# EAGLE design controller-teensy (EAGLE 6.4)
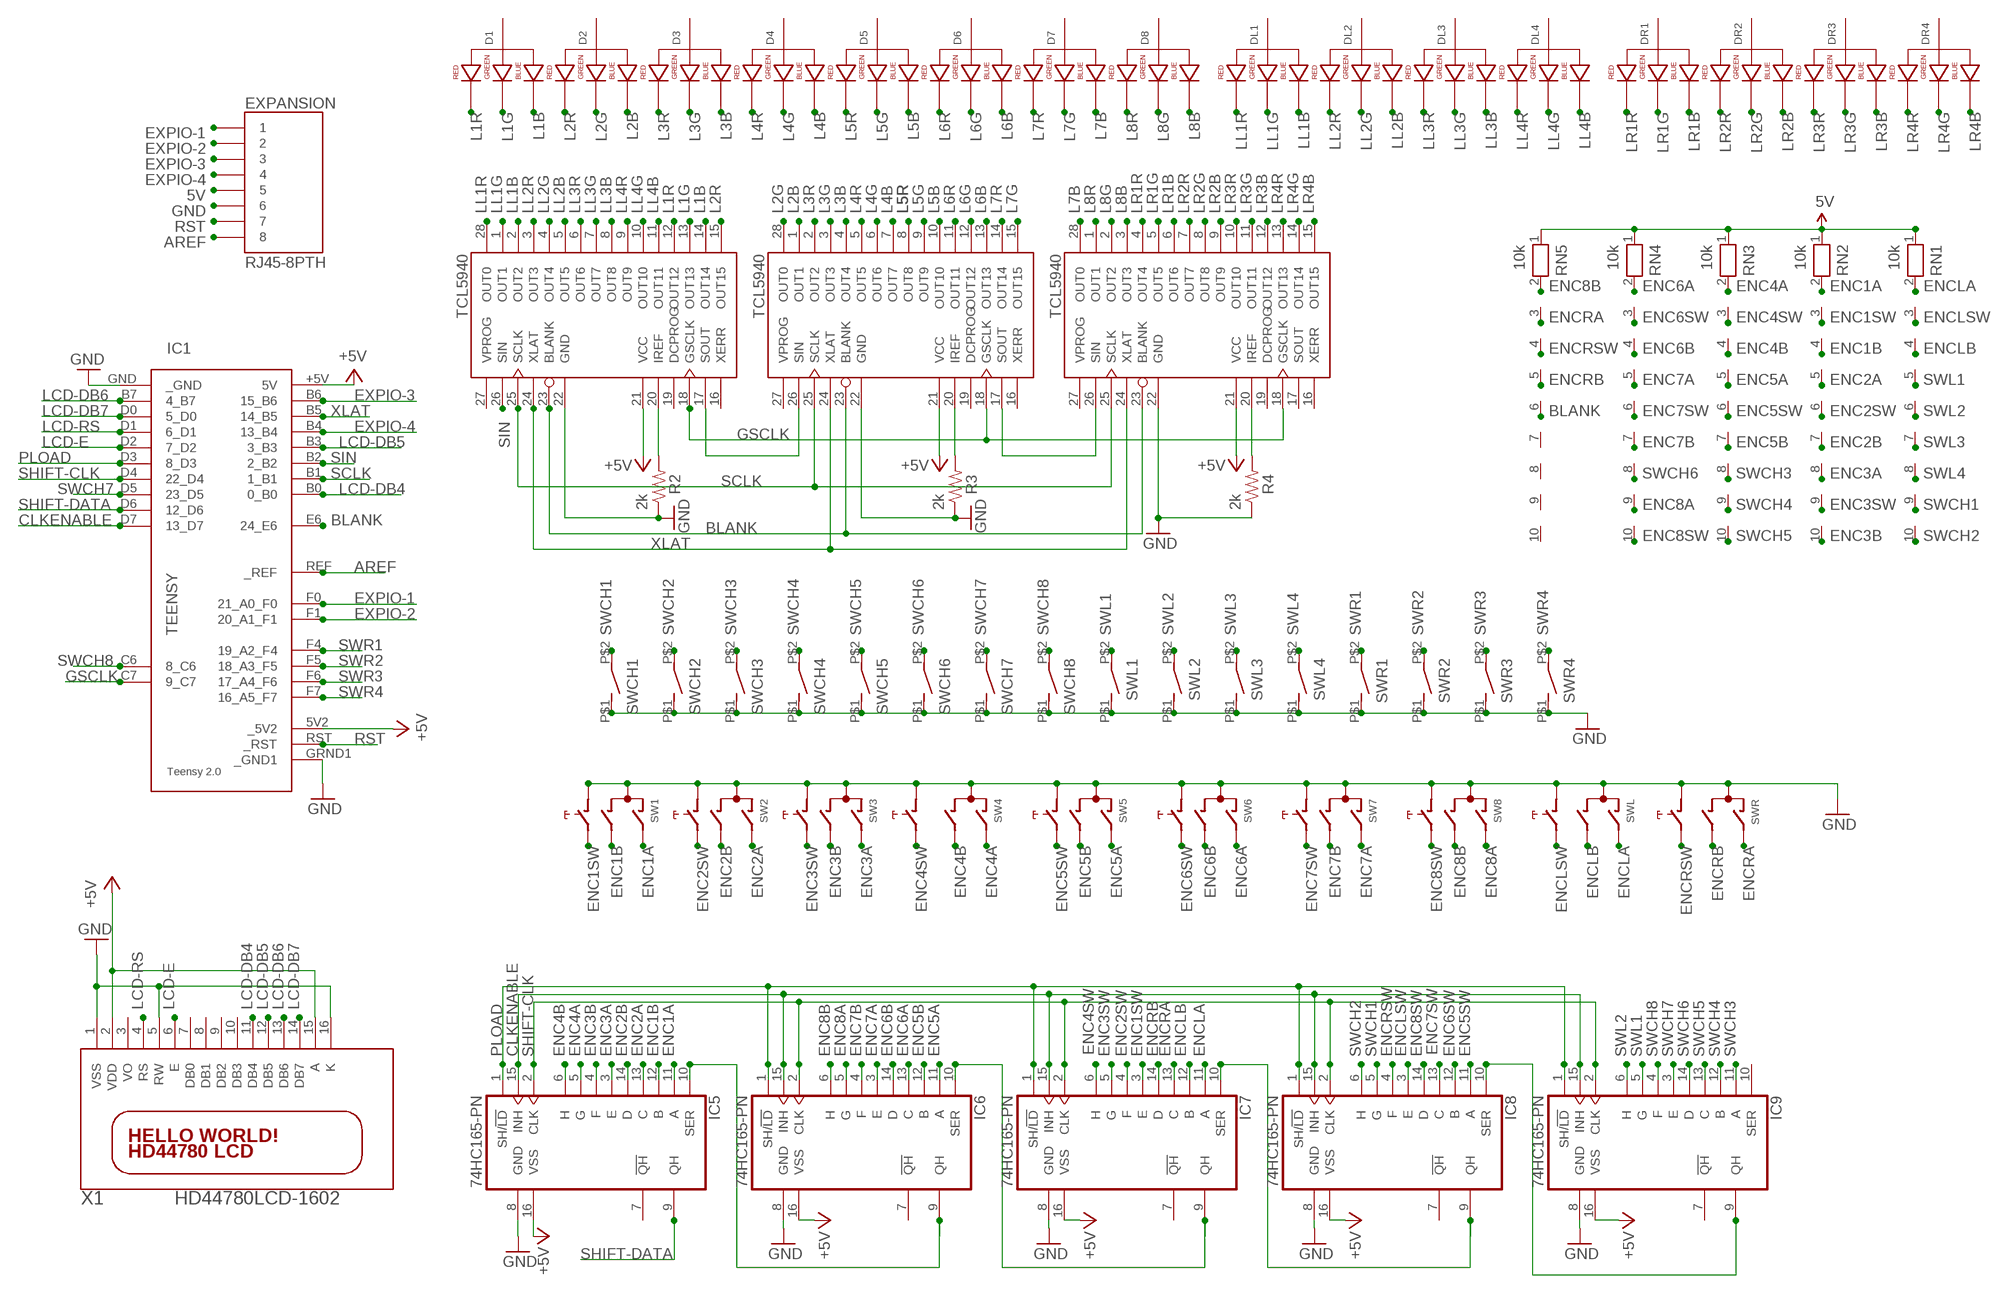
[diagram p0: schematic, sheet 1]

## Parts
D1  LED-RGB-CA-THRUDIFFUSE  [LED-RGB-THRU]
D2  LED-RGB-CA-THRUDIFFUSE  [LED-RGB-THRU]
D3  LED-RGB-CA-THRUDIFFUSE  [LED-RGB-THRU]
D4  LED-RGB-CA-THRUDIFFUSE  [LED-RGB-THRU]
D5  LED-RGB-CA-THRUDIFFUSE  [LED-RGB-THRU]
D6  LED-RGB-CA-THRUDIFFUSE  [LED-RGB-THRU]
D7  LED-RGB-CA-THRUDIFFUSE  [LED-RGB-THRU]
D8  LED-RGB-CA-THRUDIFFUSE  [LED-RGB-THRU]
DL1  LED-RGB-CA-THRUDIFFUSE  [LED-RGB-THRU]
DL2  LED-RGB-CA-THRUDIFFUSE  [LED-RGB-THRU]
DL3  LED-RGB-CA-THRUDIFFUSE  [LED-RGB-THRU]
DL4  LED-RGB-CA-THRUDIFFUSE  [LED-RGB-THRU]
DR1  LED-RGB-CA-THRUDIFFUSE  [LED-RGB-THRU]
DR2  LED-RGB-CA-THRUDIFFUSE  [LED-RGB-THRU]
DR3  LED-RGB-CA-THRUDIFFUSE  [LED-RGB-THRU]
DR4  LED-RGB-CA-THRUDIFFUSE  [LED-RGB-THRU]
EXPANSION  RJ45-8PTH  [RJ45-8]
IC1  TEENSY  [TEENSY]
IC2  LEDPWM1  TCL5940  [DIP28]
IC3  LEDPWM2  TCL5940  [DIP28]
IC4  LEDPWM3  TCL5940  [DIP28]
IC5  74HC165-PN  [DIL16]
IC6  74HC165-PN  [DIL16]
IC7  74HC165-PN  [DIL16]
IC8  74HC165-PN  [DIL16]
IC9  74HC165-PN  [DIL16]
R2  2k  R-US_0207/10  [0207/10]
R3  2k  R-US_0207/10  [0207/10]
R4  2k  R-US_0207/10  [0207/10]
RN1  10k  RN09  [RN-10]
RN2  10k  RN09  [RN-10]
RN3  10k  RN09  [RN-10]
RN4  10k  RN09  [RN-10]
RN5  10k  RN09  [RN-10]
SW1  EC12E_SW  [ALPS_EC12E_SW]
SW2  EC12E_SW  [ALPS_EC12E_SW]
SW3  EC12E_SW  [ALPS_EC12E_SW]
SW4  EC12E_SW  [ALPS_EC12E_SW]
SW5  EC12E_SW  [ALPS_EC12E_SW]
SW6  EC12E_SW  [ALPS_EC12E_SW]
SW7  EC12E_SW  [ALPS_EC12E_SW]
SW8  EC12E_SW  [ALPS_EC12E_SW]
SWCH1  BPM  [BMP]
SWCH2  BPM  [BMP]
SWCH3  BPM  [BMP]
SWCH4  BPM  [BMP]
SWCH5  BPM  [BMP]
SWCH6  BPM  [BMP]
SWCH7  BPM  [BMP]
SWCH8  BPM  [BMP]
SWL  EC12E_SW  [ALPS_EC12E_SW]
SWL1  BPM  [BMP]
SWL2  BPM  [BMP]
SWL3  BPM  [BMP]
SWL4  BPM  [BMP]
SWR  EC12E_SW  [ALPS_EC12E_SW]
SWR1  BPM  [BMP]
SWR2  BPM  [BMP]
SWR3  BPM  [BMP]
SWR4  BPM  [BMP]
X1  HD44780LCD-1602  [LCD1602]

## Nets
5V: EXPANSION.5 RN1.1 RN2.1 RN3.1 RN4.1 RN5.1
+5V: IC1.5V2(_5V2) IC1.+5V(5V) IC2.21(VCC) IC3.21(VCC) IC4.21(VCC) IC5.16(VSS) IC6.16(VSS) IC7.16(VSS) IC8.16(VSS) IC9.16(VSS) X1.2(VDD) X1.15(A)
AREF: EXPANSION.8 IC1.REF(_REF)
BLANK: IC1.E6(24_E6) IC2.23(BLANK) IC3.23(BLANK) IC4.23(BLANK) RN5.6
CLKENABLE: IC1.D7(13_D7) IC5.15(INH) IC6.15(INH) IC7.15(INH) IC8.15(INH) IC9.15(INH)
ENC1A: IC5.11(A) RN2.2 SW1.A
ENC1B: IC5.12(B) RN2.4 SW1.B
ENC1SW: IC7.3(E) RN2.3 SW1.E
ENC2A: IC5.13(C) RN2.5 SW2.A
ENC2B: IC5.14(D) RN2.7 SW2.B
ENC2SW: IC7.4(F) RN2.6 SW2.E
ENC3A: IC5.3(E) RN2.8 SW3.A
ENC3B: IC5.4(F) RN2.10 SW3.B
ENC3SW: IC7.5(G) RN2.9 SW3.E
ENC4A: IC5.5(G) RN3.2 SW4.A
ENC4B: IC5.6(H) RN3.4 SW4.B
ENC4SW: IC7.6(H) RN3.3 SW4.E
ENC5A: IC6.11(A) RN3.5 SW5.A
ENC5B: IC6.12(B) RN3.7 SW5.B
ENC5SW: IC8.11(A) RN3.6 SW5.E
ENC6A: IC6.13(C) RN4.2 SW6.A
ENC6B: IC6.14(D) RN4.4 SW6.B
ENC6SW: IC8.12(B) RN4.3 SW6.E
ENC7A: IC6.3(E) RN4.5 SW7.A
ENC7B: IC6.4(F) RN4.7 SW7.B
ENC7SW: IC8.13(C) RN4.6 SW7.E
ENC8A: IC6.5(G) RN4.9 SW8.A
ENC8B: IC6.6(H) RN5.2 SW8.B
ENC8SW: IC8.14(D) RN4.10 SW8.E
ENCLA: IC7.11(A) RN1.2 SWL.A
ENCLB: IC7.12(B) RN1.4 SWL.B
ENCLSW: IC8.3(E) RN1.3 SWL.E
ENCRA: IC7.13(C) RN5.3 SWR.A
ENCRB: IC7.14(D) RN5.5 SWR.B
ENCRSW: IC8.4(F) RN5.4 SWR.E
EXPIO-1: EXPANSION.1 IC1.F0(21_A0_F0)
EXPIO-2: EXPANSION.2 IC1.F1(20_A1_F1)
EXPIO-3: EXPANSION.3 IC1.B6(15_B6)
EXPIO-4: EXPANSION.4 IC1.B4(13_B4)
GND: EXPANSION.6 IC1.GND(_GND) IC1.GRND1(_GND1) IC2.22(GND) IC3.22(GND) IC4.22(GND) IC5.8(GND) IC6.8(GND) IC7.8(GND) IC8.8(GND) IC9.8(GND) R2.1 R3.1 R4.1 SW1.C SW1.D SW2.C SW2.D SW3.C SW3.D SW4.C SW4.D SW5.C SW5.D SW6.C SW6.D SW7.C SW7.D SW8.C SW8.D SWCH1.P$1 SWCH2.P$1 SWCH3.P$1 SWCH4.P$1 SWCH5.P$1 SWCH6.P$1 SWCH7.P$1 SWCH8.P$1 SWL1.P$1 SWL2.P$1 SWL3.P$1 SWL4.P$1 SWL.C SWL.D SWR1.P$1 SWR2.P$1 SWR3.P$1 SWR4.P$1 SWR.C SWR.D X1.1(VSS) X1.5(RW) X1.16(K)
GSCLK: IC1.C7(9_C7) IC2.18(GSCLK) IC3.18(GSCLK) IC4.18(GSCLK)
L1B: D1.4(BLUE_CATHODE) IC2.14(OUT14)
L1G: D1.3(GREEN_CATHODE) IC2.13(OUT13)
L1R: D1.1(RED_CATHODE) IC2.12(OUT12)
L2B: D2.4(BLUE_CATHODE) IC3.1(OUT1)
L2G: D2.3(GREEN_CATHODE) IC3.28(OUT0)
L2R: D2.1(RED_CATHODE) IC2.15(OUT15)
L3B: D3.4(BLUE_CATHODE) IC3.4(OUT4)
L3G: D3.3(GREEN_CATHODE) IC3.3(OUT3)
L3R: D3.1(RED_CATHODE) IC3.2(OUT2)
L4B: D4.4(BLUE_CATHODE) IC3.7(OUT7)
L4G: D4.3(GREEN_CATHODE) IC3.6(OUT6)
L4R: D4.1(RED_CATHODE) IC3.5(OUT5)
L5B: D5.4(BLUE_CATHODE) IC3.10(OUT10)
L5G: D5.3(GREEN_CATHODE) IC3.9(OUT9)
L5R: D5.1(RED_CATHODE) IC3.8(OUT8)
L6B: D6.4(BLUE_CATHODE) IC3.13(OUT13)
L6G: D6.3(GREEN_CATHODE) IC3.12(OUT12)
L6R: D6.1(RED_CATHODE) IC3.11(OUT11)
L7B: D7.4(BLUE_CATHODE) IC4.28(OUT0)
L7G: D7.3(GREEN_CATHODE) IC3.15(OUT15)
L7R: D7.1(RED_CATHODE) IC3.14(OUT14)
L8B: D8.4(BLUE_CATHODE) IC4.3(OUT3)
L8G: D8.3(GREEN_CATHODE) IC4.2(OUT2)
L8R: D8.1(RED_CATHODE) IC4.1(OUT1)
LCD-DB4: IC1.B0(0_B0) X1.11(DB4)
LCD-DB5: IC1.B3(3_B3) X1.12(DB5)
LCD-DB6: IC1.B7(4_B7) X1.13(DB6)
LCD-DB7: IC1.D0(5_D0) X1.14(DB7)
LCD-E: IC1.D2(7_D2) X1.6(E)
LCD-RS: IC1.D1(6_D1) X1.4(RS)
LL1B: DL1.4(BLUE_CATHODE) IC2.2(OUT2)
LL1G: DL1.3(GREEN_CATHODE) IC2.1(OUT1)
LL1R: DL1.1(RED_CATHODE) IC2.28(OUT0)
LL2B: DL2.4(BLUE_CATHODE) IC2.5(OUT5)
LL2G: DL2.3(GREEN_CATHODE) IC2.4(OUT4)
LL2R: DL2.1(RED_CATHODE) IC2.3(OUT3)
LL3B: DL3.4(BLUE_CATHODE) IC2.8(OUT8)
LL3G: DL3.3(GREEN_CATHODE) IC2.7(OUT7)
LL3R: DL3.1(RED_CATHODE) IC2.6(OUT6)
LL4B: DL4.4(BLUE_CATHODE) IC2.11(OUT11)
LL4G: DL4.3(GREEN_CATHODE) IC2.10(OUT10)
LL4R: DL4.1(RED_CATHODE) IC2.9(OUT9)
LR1B: DR1.4(BLUE_CATHODE) IC4.6(OUT6)
LR1G: DR1.3(GREEN_CATHODE) IC4.5(OUT5)
LR1R: DR1.1(RED_CATHODE) IC4.4(OUT4)
LR2B: DR2.4(BLUE_CATHODE) IC4.9(OUT9)
LR2G: DR2.3(GREEN_CATHODE) IC4.8(OUT8)
LR2R: DR2.1(RED_CATHODE) IC4.7(OUT7)
LR3B: DR3.4(BLUE_CATHODE) IC4.12(OUT12)
LR3G: DR3.3(GREEN_CATHODE) IC4.11(OUT11)
LR3R: DR3.1(RED_CATHODE) IC4.10(OUT10)
LR4B: DR4.4(BLUE_CATHODE) IC4.15(OUT15)
LR4G: DR4.3(GREEN_CATHODE) IC4.14(OUT14)
LR4R: DR4.1(RED_CATHODE) IC4.13(OUT13)
N$10: IC3.20(IREF) R3.2
N$13: IC2.20(IREF) R2.2
N$14: IC2.17(SOUT) IC3.26(SIN)
N$15: IC3.17(SOUT) IC4.26(SIN)
N$16: IC4.20(IREF) R4.2
N$21: IC5.10(SER) IC6.9(QH)
N$22: IC6.10(SER) IC7.9(QH)
N$23: IC7.10(SER) IC8.9(QH)
N$33: IC8.10(SER) IC9.9(QH)
PLOAD: IC1.D3(8_D3) IC5.1(SH/!LD) IC6.1(SH/!LD) IC7.1(SH/!LD) IC8.1(SH/!LD) IC9.1(SH/!LD)
RST: EXPANSION.7 IC1.RST(_RST)
SCLK: IC1.B1(1_B1) IC2.25(SCLK) IC3.25(SCLK) IC4.25(SCLK)
SHIFT-CLK: IC1.D4(22_D4) IC5.2(CLK) IC6.2(CLK) IC7.2(CLK) IC8.2(CLK) IC9.2(CLK)
SHIFT-DATA: IC1.D6(12_D6) IC5.9(QH)
SIN: IC1.B2(2_B2) IC2.26(SIN)
SWCH1: IC8.5(G) RN1.9 SWCH1.P$2
SWCH2: IC8.6(H) RN1.10 SWCH2.P$2
SWCH3: IC9.11(A) RN3.8 SWCH3.P$2
SWCH4: IC9.12(B) RN3.9 SWCH4.P$2
SWCH5: IC9.13(C) RN3.10 SWCH5.P$2
SWCH6: IC9.14(D) RN4.8 SWCH6.P$2
SWCH7: IC1.D5(23_D5) IC9.3(E) SWCH7.P$2
SWCH8: IC1.C6(8_C6) IC9.4(F) SWCH8.P$2
SWL1: IC9.5(G) RN1.5 SWL1.P$2
SWL2: IC9.6(H) RN1.6 SWL2.P$2
SWL3: RN1.7 SWL3.P$2
SWL4: RN1.8 SWL4.P$2
SWR1: IC1.F4(19_A2_F4) SWR1.P$2
SWR2: IC1.F5(18_A3_F5) SWR2.P$2
SWR3: IC1.F6(17_A4_F6) SWR3.P$2
SWR4: IC1.F7(16_A5_F7) SWR4.P$2
XLAT: IC1.B5(14_B5) IC2.24(XLAT) IC3.24(XLAT) IC4.24(XLAT)
Unconnected: D1.2(ANODE) D2.2(ANODE) D3.2(ANODE) D4.2(ANODE) D5.2(ANODE) D6.2(ANODE) D7.2(ANODE) D8.2(ANODE) DL1.2(ANODE) DL2.2(ANODE) DL3.2(ANODE) DL4.2(ANODE) DR1.2(ANODE) DR2.2(ANODE) DR3.2(ANODE) DR4.2(ANODE) IC2.16(XERR) IC2.19(DCPROG) IC2.27(VPROG) IC3.16(XERR) IC3.19(DCPROG) IC3.27(VPROG) IC4.16(XERR) IC4.17(SOUT) IC4.19(DCPROG) IC4.27(VPROG) IC5.7(!QH) IC6.7(!QH) IC7.7(!QH) IC8.7(!QH) IC9.7(!QH) IC9.10(SER) RN5.7 RN5.8 RN5.9 RN5.10 SW1.GND1(G) SW1.GND2(G) SW2.GND1(G) SW2.GND2(G) SW3.GND1(G) SW3.GND2(G) SW4.GND1(G) SW4.GND2(G) SW5.GND1(G) SW5.GND2(G) SW6.GND1(G) SW6.GND2(G) SW7.GND1(G) SW7.GND2(G) SW8.GND1(G) SW8.GND2(G) SWL.GND1(G) SWL.GND2(G) SWR.GND1(G) SWR.GND2(G) X1.3(VO) X1.7(DB0) X1.8(DB1) X1.9(DB2) X1.10(DB3)

## Library data of the parts
D1-D8 DL1-DL4 DR1-DR4 = SparkFun-LED:LED-RGB-CA-THRU: RGB Through-hole common anode SparkFun store front COM-10821 (diffuse) COM-10820 (clear); PROD_ID: DIO-10632
EXPANSION = SparkFun:RJ45-8: RJ45 Jack Simple RJ45, 8-pin connection - connector for common Cat5, Cat5e, and Cat6 Ethernet cables. Footprint not yet proven in production. Connector sku is PRT-00643; Breakout PCB sku is BOB-00716.
IC1 = teensy:TEENSY: Teensy 2.0 Original Design by Clint Fisher Modified Design by Tamir Emran Licensed Under Creative Commons Attribution-ShareAlike 3.0 Unported (CC BY-SA 3.0)
IC2-IC4 = tcl5940:TCL5940: 16-Channel 12-Bit LED Driver
IC5-IC9 = 74xx-us:74*165-P: 8-bit parallel load SHIFT REGISTER; PWR: 1
R2-R4 = resistor:R-US_: RESISTOR, American symbol
RN1-RN5 = resistor-net:RN09: RESISTOR NETWORK; OC_FARNELL: unknown; OC_NEWARK: unknown
SW1-SW8 SWL SWR = switch-alps:EC12E_SW: ALPS rotary Encoder EC12E series with switch; MPN: EC12E2424407; OC_FARNELL: 1520813; OC_NEWARK: 74M1068
SWCH1-SWCH8 SWL1-SWL4 SWR1-SWR4 = livid:BPM
X1 = adafruit:HD44780LCD: HD44780 LCD Standard character type LCDs, available in sizes from 8x1 to 40x4!

## Board
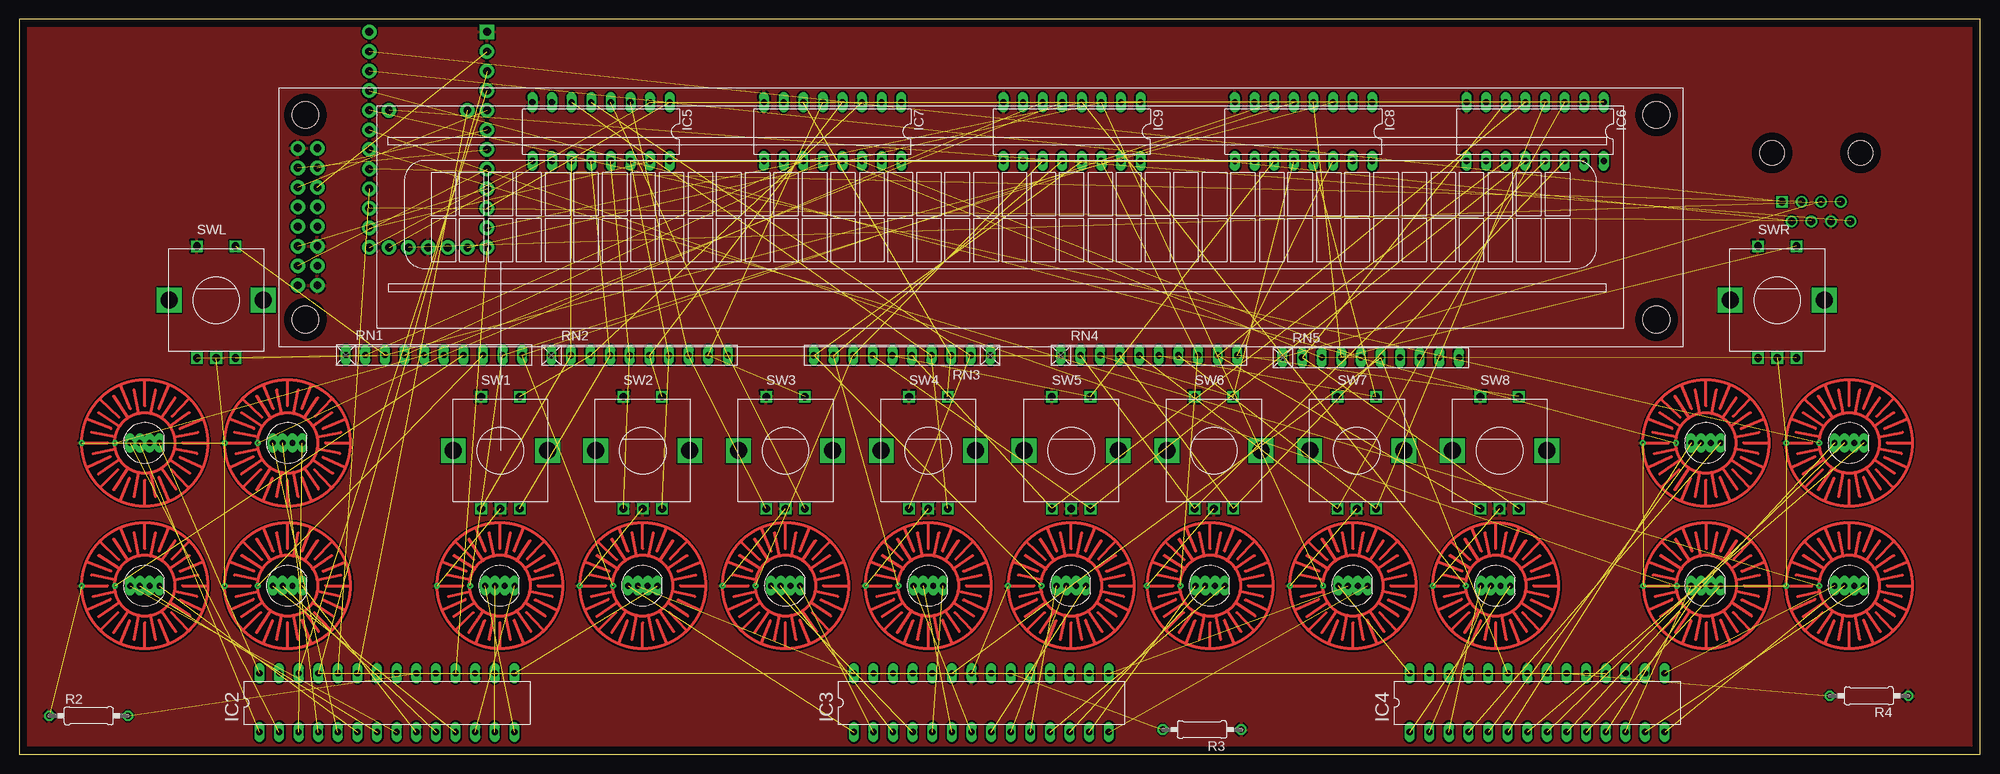
[diagram p1: board, top side]
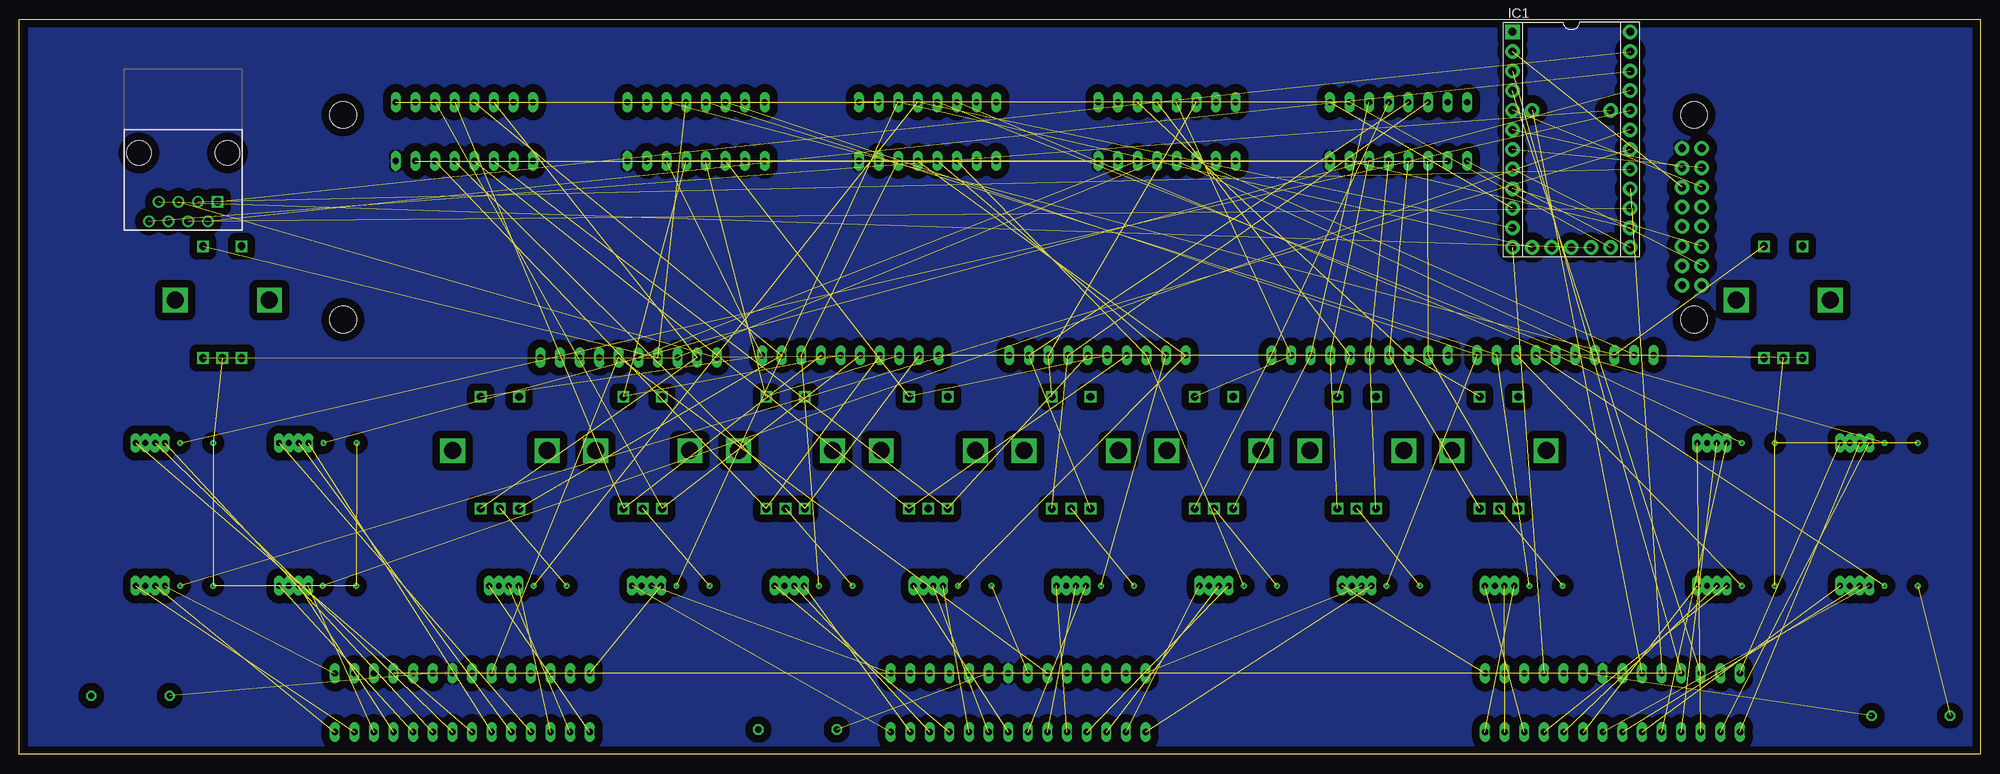
[diagram p2: board, bottom side, seen from below]

Size 254 x 95.25 mm. Coordinates in mm from the lower left corner, seen from the top.
Outline: 0,0 254,0 254,95.25 0,95.25 0,0
Copper layers (1*16): Top 0.035mm / dielectric 1.5mm / Bottom 0.035mm
Design rules "default": minimum track width 10mil, minimum drill 24mil, track to track 8mil, track to pad 8mil, pad to pad 8mil, via to via 8mil, smd to smd 8mil, copper to edge 40mil, drill to drill 8mil, minimum pad ring 10mil, minimum via ring 8mil, stop-mask expansion 4mil, vias tented up to drill 0mil, thermal gap 10mil

### Footprints (pad centres in the part's own frame; a part is rotated, then mirrored left to right if it is on the bottom)
LED-RGB-THRU = drill 0.762 pad 0.889 long: 1 1.905,0; 2 0.635,0; 3 -0.635,0; 4 -1.905,0
RJ45-8 = drill 1 square: 1 -4.445,6.35 | drill 1: 2 -3.175,8.89; 3 -1.905,6.35; 4 -0.635,8.89; 5 0.635,6.35; 6 1.905,8.89; 7 3.175,6.35; 8 4.445,8.89 | hole 3.2: -5.715,0; 5.715,0
TEENSY = drill 1.016 pad 1.88: 5V2 13.97,-2.54; +5V -13.97,7.62; B0 -11.43,-7.62; B1 -8.89,-7.62; B2 -6.35,-7.62; B3 -3.81,-7.62; B4 8.89,7.62; B5 6.35,7.62; B6 3.81,7.62; B7 -1.27,-7.62; C6 11.43,-7.62; C7 13.97,-7.62; D0 1.27,-7.62; D1 3.81,-7.62; D2 6.35,-7.62; D3 8.89,-7.62; D4 13.97,5.08; D5 13.97,-5.08; D6 13.97,7.62; D7 11.43,7.62; E6 -3.81,-5.08; F0 -11.43,7.62; F1 -8.89,7.62; F4 -6.35,7.62; F5 -3.81,7.62; F6 -1.27,7.62; F7 1.27,7.62; GRND1 13.97,0; REF -3.81,5.08; RST 13.97,2.54 | drill 1.016 pad 1.88 square: GND -13.97,-7.62
DIP28 = drill 0.813 long: 1 -15.24,-3.81; 2 -12.7,-3.81; 3 -10.16,-3.81; 4 -7.62,-3.81; 5 -5.08,-3.81; 6 -2.54,-3.81; 7 0,-3.81; 8 2.54,-3.81; 9 5.08,-3.81; 10 7.62,-3.81; 11 10.16,-3.81; 12 12.7,-3.81; 13 15.24,-3.81; 14 17.78,-3.81; 15 17.78,3.81; 16 15.24,3.81; 17 12.7,3.81; 18 10.16,3.81; 19 7.62,3.81; 20 5.08,3.81; 21 2.54,3.81; 22 0,3.81; 23 -2.54,3.81; 24 -5.08,3.81; 25 -7.62,3.81; 26 -10.16,3.81; 27 -12.7,3.81; 28 -15.24,3.81
DIL16 = drill 0.813 long: 1 -8.89,-3.81; 2 -6.35,-3.81; 3 -3.81,-3.81; 4 -1.27,-3.81; 5 1.27,-3.81; 6 3.81,-3.81; 7 6.35,-3.81; 8 8.89,-3.81; 9 8.89,3.81; 10 6.35,3.81; 11 3.81,3.81; 12 1.27,3.81; 13 -1.27,3.81; 14 -3.81,3.81; 15 -6.35,3.81; 16 -8.89,3.81
0207/10 = drill 0.813 octagon: 1 -5.08,0; 2 5.08,0
RN-10 = drill 0.813 long: 1 -11.43,0; 2 -8.89,0; 3 -6.35,0; 4 -3.81,0; 5 -1.27,0; 6 1.27,0; 7 3.81,0; 8 6.35,0; 9 8.89,0; 10 11.43,0
ALPS_EC12E_SW = drill 1 square: A -2.5,-7.5; B 2.5,-7.5; C 0,-7.5; D -2.5,7; E 2.5,7 | drill 2.2 square: GND1 -6.1,0; GND2 6.1,0
BMP = drill 0.254: P$1 -8.159,0; P$2 -3.858,0
LCD1602 = drill 1.016 pad 1.88: 1 5.04,7.92; 2 2.5,7.92; 3 5.04,10.46; 4 2.5,10.46; 5 5.04,13; 6 2.5,13; 7 5.04,15.54; 8 2.5,15.54; 9 5.04,18.08; 10 2.5,18.08; 11 5.04,20.62; 12 2.5,20.62; 13 5.04,23.16; 14 2.5,23.16; 15 5.04,25.7; 16 2.5,25.7 | hole 3.5: 3.5,3.5; 3.5,30; 178.5,30; 178.5,3.5

### Placement (x,y rotation side)
D1  62.25,21.85 0 top
D2  80.75,21.85 0 top
D3  99.25,21.85 0 top
D4  117.75,21.85 0 top
D5  136.25,21.85 0 top
D6  154.25,21.85 0 top
D7  172.75,21.85 0 top
D8  191.25,21.85 0 top
DL1  16.25,40.35 0 top
DL2  34.75,40.35 0 top
DL3  16.25,21.85 0 top
DL4  34.75,21.85 0 top
DR1  218.46,40.35 0 top
DR2  237.04,40.35 0 top
DR3  218.46,21.85 0 top
DR4  237.04,21.85 0 top
EXPANSION  232.76,77.96 180 bottom
IC1  52.96,79.65 270 bottom
IC2  46.35,6.7 0 top
IC3  123.35,6.7 0 top
IC4  195.35,6.7 0 top
IC5  75.35,80.7 180 top
IC6  196.35,80.7 180 top
IC7  105.35,80.7 180 top
IC8  166.35,80.7 180 top
IC9  136.35,80.7 180 top
R2  8.99,4.99 0 top
R3  153.2,3.21 180 top
R4  239.59,7.59 180 top
RN1  53.72,51.75 0 top
RN2  80.35,51.7 0 top
RN3  114.35,51.7 180 top
RN4  146.35,51.7 0 top
RN5  175.07,51.41 0 top
SW1  62.32,39.35 0 top
SW2  80.75,39.35 0 top
SW3  99.25,39.35 0 top
SW4  117.75,39.35 0 top
SW5  136.25,39.35 0 top
SW6  154.75,39.35 0 top
SW7  173.25,39.35 0 top
SW8  191.75,39.35 0 top
SWCH1  62.25,21.85 0 top
SWCH2  80.75,21.85 0 top
SWCH3  99.25,21.85 0 top
SWCH4  117.75,21.85 0 top
SWCH5  136.25,21.85 0 top
SWCH6  154.25,21.85 0 top
SWCH7  172.75,21.85 0 top
SWCH8  191.25,21.85 0 top
SWL  25.5,58.85 0 top
SWL1  16.25,40.35 0 top
SWL2  34.75,40.35 0 top
SWL3  16.25,21.85 0 top
SWL4  34.75,21.85 0 top
SWR  227.71,58.85 0 top
SWR1  218.46,40.35 0 top
SWR2  237.04,40.35 0 top
SWR3  218.54,21.85 0 top
SWR4  237.04,21.85 0 top
X1  33.57,52.85 0 top

### Tracks (layer width: path | path; a pad name or v marks a point on that pad's centre or on a via)
5V  (5 unrouted)
+5V
  pour Bottom (isolate 1.016): 1,94.05 252.7,94.05 252.7,1 1,1
AREF  (1 unrouted)
BLANK  (4 unrouted)
CLKENABLE  (5 unrouted)
ENC1A  (2 unrouted)
ENC1B  (2 unrouted)
ENC1SW  (2 unrouted)
ENC2A  (2 unrouted)
ENC2B  (2 unrouted)
ENC2SW  (2 unrouted)
ENC3A  (2 unrouted)
ENC3B  (2 unrouted)
ENC3SW  (2 unrouted)
ENC4A  (2 unrouted)
ENC4B  (2 unrouted)
ENC4SW  (2 unrouted)
ENC5A  (2 unrouted)
ENC5B  (2 unrouted)
ENC5SW  (2 unrouted)
ENC6A  (2 unrouted)
ENC6B  (2 unrouted)
ENC6SW  (2 unrouted)
ENC7A  (2 unrouted)
ENC7B  (2 unrouted)
ENC7SW  (2 unrouted)
ENC8A  (2 unrouted)
ENC8B  (2 unrouted)
ENC8SW  (2 unrouted)
ENCLA  (2 unrouted)
ENCLB  (2 unrouted)
ENCLSW  (2 unrouted)
ENCRA  (2 unrouted)
ENCRB  (2 unrouted)
ENCRSW  (2 unrouted)
EXPIO-1  (1 unrouted)
EXPIO-2  (1 unrouted)
EXPIO-3  (1 unrouted)
EXPIO-4  (1 unrouted)
GND  (16 unrouted)
  pour Top: 0,95.05 253.7,95.05 253.7,1 0,1
GSCLK  (3 unrouted)
L1B  (1 unrouted)
L1G  (1 unrouted)
L1R  (1 unrouted)
L2B  (1 unrouted)
L2G  (1 unrouted)
L2R  (1 unrouted)
L3B  (1 unrouted)
L3G  (1 unrouted)
L3R  (1 unrouted)
L4B  (1 unrouted)
L4G  (1 unrouted)
L4R  (1 unrouted)
L5B  (1 unrouted)
L5G  (1 unrouted)
L5R  (1 unrouted)
L6B  (1 unrouted)
L6G  (1 unrouted)
L6R  (1 unrouted)
L7B  (1 unrouted)
L7G  (1 unrouted)
L7R  (1 unrouted)
L8B  (1 unrouted)
L8G  (1 unrouted)
L8R  (1 unrouted)
LCD-DB4  (1 unrouted)
LCD-DB5  (1 unrouted)
LCD-DB6  (1 unrouted)
LCD-DB7  (1 unrouted)
LCD-E  (1 unrouted)
LCD-RS  (1 unrouted)
LL1B  (1 unrouted)
LL1G  (1 unrouted)
LL1R  (1 unrouted)
LL2B  (1 unrouted)
LL2G  (1 unrouted)
LL2R  (1 unrouted)
LL3B  (1 unrouted)
LL3G  (1 unrouted)
LL3R  (1 unrouted)
LL4B  (1 unrouted)
LL4G  (1 unrouted)
LL4R  (1 unrouted)
LR1B  (1 unrouted)
LR1G  (1 unrouted)
LR1R  (1 unrouted)
LR2B  (1 unrouted)
LR2G  (1 unrouted)
LR2R  (1 unrouted)
LR3B  (1 unrouted)
LR3G  (1 unrouted)
LR3R  (1 unrouted)
LR4B  (1 unrouted)
LR4G  (1 unrouted)
LR4R  (1 unrouted)
N$10  (1 unrouted)
N$13  (1 unrouted)
N$14  (1 unrouted)
N$15  (1 unrouted)
N$16  (1 unrouted)
N$21  (1 unrouted)
N$22  (1 unrouted)
N$23  (1 unrouted)
N$33  (1 unrouted)
PLOAD  (5 unrouted)
RST  (1 unrouted)
SCLK  (3 unrouted)
SHIFT-CLK  (5 unrouted)
SHIFT-DATA  (1 unrouted)
SIN  (1 unrouted)
SWCH1  (2 unrouted)
SWCH2  (2 unrouted)
SWCH3  (2 unrouted)
SWCH4  (2 unrouted)
SWCH5  (2 unrouted)
SWCH6  (2 unrouted)
SWCH7  (2 unrouted)
SWCH8  (2 unrouted)
SWL1  (2 unrouted)
SWL2  (2 unrouted)
SWL3  (1 unrouted)
SWL4  (1 unrouted)
SWR1  (1 unrouted)
SWR2  (1 unrouted)
SWR3  (1 unrouted)
SWR4  (1 unrouted)
XLAT  (3 unrouted)